# EAGLE schematic MultiDrop (EAGLE 7.6.0)
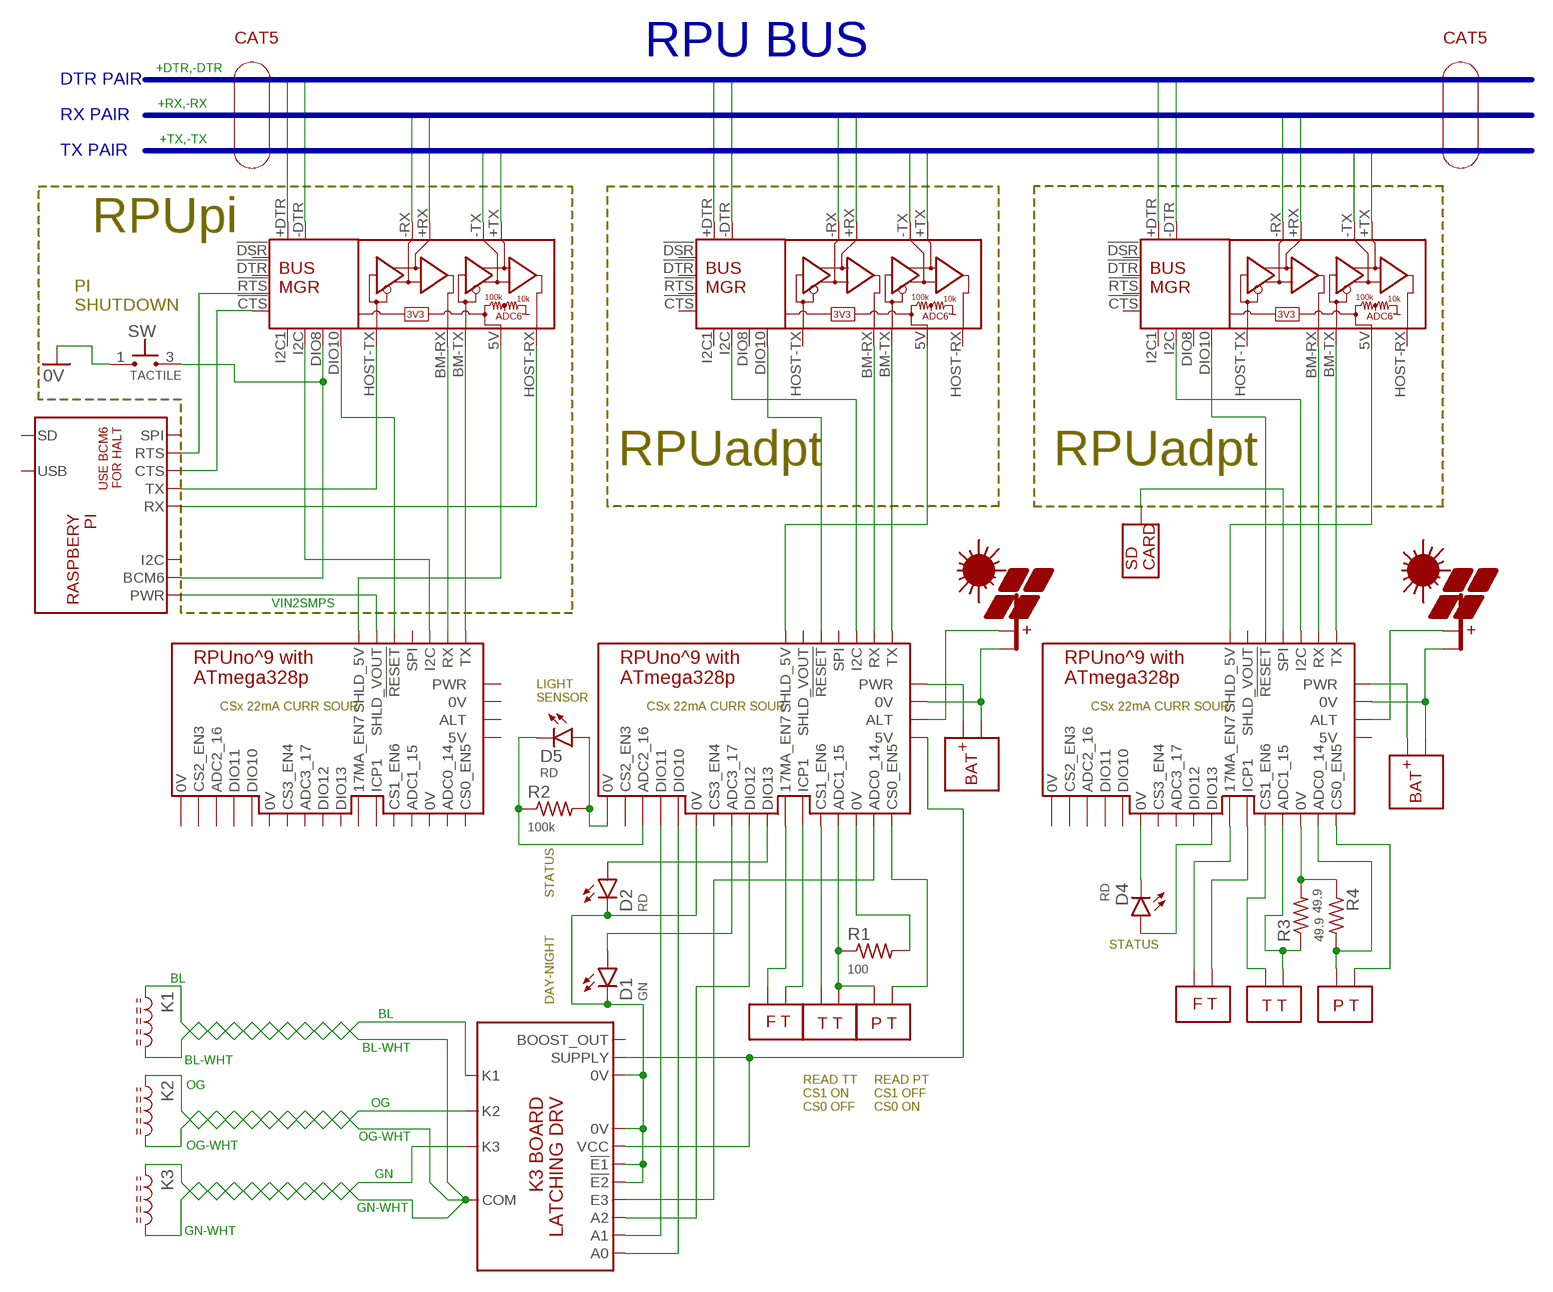
[diagram p0: schematic, sheet 1]

## Parts
BM1  RPUNO  [NA-30]
BM2  RPUNO  [NA-30]
BM3  RPUNO  [NA-30]
D1  GN  LED5MM  [LED5MM]
D2  RD  LED5MM  [LED5MM]
D4  RD  LED5MM  [LED5MM]
D5  RD  LED5MM  [LED5MM]
K1  L0805  [C0805(2012)]
K2  L0805  [C0805(2012)]
K3  L0805  [C0805(2012)]
PV2  PV  [NA-30]
PV4  PV  [NA-30]
R1  100  R0805  [C0805(2012)]
R2  100k  R0805  [C0805(2012)]
R3  49.9  R0805  [C0805(2012)]
R4  49.9  R0805  [C0805(2012)]
SD2  SD  [NA-30]
SW  TACTILE  TAC_SW  [KS11]
U$1  BUS_MGR  [WITH_RPU_NAMES]
U$2  BUS_MGR  [WITH_RPU_NAMES]
U$3  BUS_MGR  [WITH_RPU_NAMES]
U$4  K3  [NA-30]
U$5  FT  [NA-30]
U$6  TT  [NA-30]
U$7  BAT  [NA-30]
U$8  PT  [NA-30]
U$9  BAT  [NA-30]
U$10  TT  [NA-30]
U$11  PT  [NA-30]
U$12  FT  [NA-30]
U$13  PI  [NA-30]

## Nets
0V: SW.1
+DTR: U$3.+DTR
+DTR1: U$2.+DTR
+DTR3: U$1.+DTR
+RX: U$3.+RX
+RX1: U$2.+RX
+RX3: U$1.+RX
+TX: U$3.+TX
+TX1: U$2.+TX
+TX3: U$1.+TX
-DTR: U$3.-DTR
-DTR1: U$2.-DTR
-DTR3: U$1.-DTR
-RX: U$3.-RX
-RX1: U$2.-RX
-RX3: U$1.-RX
-TX: U$3.-TX
-TX1: U$2.-TX
-TX3: U$1.-TX
BL: K1.1 U$4.11(K1)
BL-WHT: K1.2 U$4.9(COM)
GN: K3.1 U$4.13(K3)
GN-WHT: K3.2
N$1: BM2.1(TX) U$3.BM-TX(BM_TX)
N$2: BM2.2(RX) U$3.BM-RX(BM_RX)
N$3: SW.3 U$3.DIO8 U$13.7(BCM6)
N$4: U$3.!CTS U$13.1(CTS)
N$5: U$3.!RTS U$13.2(RTS)
N$6: BM1.27(0V) D5.A R2.2
N$7: BM1.13(ADC2_16) D5.K R2.1
N$8: U$3.HOST-RX(HOST_RX) U$13.3(RX)
N$9: U$3.HOST-TX(HOST_TX) U$13.4(TX)
N$10: BM1.1(TX) U$2.BM-TX(BM_TX)
N$11: BM1.2(RX) U$2.BM-RX(BM_RX)
N$12: BM1.9(0V) PV2.2(-PV) U$9.2(-BAT)
N$13: BM3.9(0V) PV4.2(-PV) U$7.2(-BAT)
N$14: BM3.1(TX) U$1.BM-TX(BM_TX)
N$15: BM3.20(ALT) PV4.1(+PV)
N$16: BM3.8(PWR) U$7.1(+BAT)
N$17: BM1.19(5V) U$4.14(SUPPLY) U$4.15(VCC)
N$18: BM3.26(0V) R3.2 R4.1
N$19: BM1.11(ADC0_14) U$4.10(E3)
N$20: BM3.18(DIO13) D4.A
N$21: BM3.2(RX) U$1.BM-RX(BM_RX)
N$22: BM1.20(ALT) PV2.1(+PV)
N$23: BM3.21(17MA_EN7) U$12.2(PWR)
N$24: BM1.15(DIO10) U$4.5(A0)
N$25: BM1.14(DIO11) U$4.6(A1)
N$26: BM1.17(DIO12) U$4.7(A2)
N$27: BM1.26(0V) R1.2
N$28: BM3.4(SPI) SD2.1(PV_PWR)
N$29: BM2.6(SHLD_5V) U$3.5V(PWR)
N$30: BM2.5(!RESET) U$3.DIO10
N$31: BM3.10(ADC1_15) R3.1 U$10.1(4TO20)
N$32: BM3.3(I2C) U$1.I2C
N$33: BM2.3(I2C) U$3.I2C
N$34: BM3.22(CS1_EN6) U$10.2(PWR)
N$35: BM3.12(ICP1) U$12.1(PL)
N$36: BM1.18(DIO13) D2.A
N$37: BM1.16(ADC3_17) D1.A
N$38: BM3.11(ADC0_14) R4.2 U$8.2(PWR)
N$39: BM3.23(CS0_EN5) U$8.1(4TO20)
N$40: BM1.28(0V) D1.K D2.K U$4.1(!E1) U$4.2(!E2) U$4.3(0V) U$4.4(0V)
N$41: BM3.6(SHLD_5V) U$1.5V(PWR)
N$42: BM1.8(PWR) U$9.1(+BAT)
N$43: BM3.5(!RESET) U$1.DIO10
N$44: BM1.5(!RESET) U$2.DIO10
N$45: BM1.6(SHLD_5V) U$2.5V(PWR)
N$47: BM1.21(17MA_EN7) U$5.2(PWR)
N$48: BM1.3(I2C) U$2.I2C
N$49: BM1.12(ICP1) U$5.1(PL)
N$50: BM1.22(CS1_EN6) U$6.2(PWR)
N$51: BM1.10(ADC1_15) R1.1 U$6.1(4TO20) U$11.2(PWR)
N$53: BM1.23(CS0_EN5) U$11.1(4TO20)
N$56: BM3.28(0V) D4.K
OG: K2.1 U$4.12(K2)
OG-WHT: K2.2
VIN2SMPS: BM2.7(SHLD_VOUT) U$13.12(PWR)
Unconnected: BM1.4(SPI) BM1.7(SHLD_VOUT) BM1.24(CS2_EN3) BM1.29(CS3_EN4) BM2.4(SPI) BM2.8(PWR) BM2.9(0V) BM2.10(ADC1_15) BM2.11(ADC0_14) BM2.12(ICP1) BM2.13(ADC2_16) BM2.14(DIO11) BM2.15(DIO10) BM2.16(ADC3_17) BM2.17(DIO12) BM2.18(DIO13) BM2.19(5V) BM2.20(ALT) BM2.21(17MA_EN7) BM2.22(CS1_EN6) BM2.23(CS0_EN5) BM2.24(CS2_EN3) BM2.26(0V) BM2.27(0V) BM2.28(0V) BM2.29(CS3_EN4) BM3.7(SHLD_VOUT) BM3.13(ADC2_16) BM3.14(DIO11) BM3.15(DIO10) BM3.16(ADC3_17) BM3.17(DIO12) BM3.19(5V) BM3.24(CS2_EN3) BM3.27(0V) BM3.29(CS3_EN4) U$1.!CTS U$1.!DSR U$1.!DTR U$1.!RTS U$1.DIO8 U$1.HOST-RX(HOST_RX) U$1.HOST-TX(HOST_TX) U$1.I2C1 U$2.!CTS U$2.!DSR U$2.!DTR U$2.!RTS U$2.DIO8 U$2.HOST-RX(HOST_RX) U$2.HOST-TX(HOST_TX) U$2.I2C1 U$3.!DSR U$3.!DTR U$3.I2C1 U$4.8(BOOST_OUT) U$13.8(I2C) U$13.9(SD) U$13.10(SPI) U$13.11(USB)

## Buses
+DTR,-DTR
+RX,-RX
+TX,-TX

## Notes on the sheet
- CAT5 | CAT5
- RPU BUS
- DTR PAIR
- RX PAIR
- TX PAIR
- RPUpi
- PI
  SHUTDOWN
- RPUadpt | RPUadpt
- LIGHT
  SENSOR
- STATUS
- STATUS
- DAY-NIGHT
- READ TT
  CS1 ON 
  CS0 OFF
- READ PT 
  CS1 OFF 
  CS0 ON

## Library data of the parts
BM1-BM3 = Documentation:RPUNO: BM /w 328p
D1 D2 D4 D5 = D-LED:LED: LED 120120WH [CREE,XHGAWT-00-0000-00000HXE1] LED WHITE 6500K 150LUM-W120120
K1-K3 = L-PWR:L: Inductor
PV2 PV4 = Documentation:PV
R1-R4 = R-C:R: Resiistor American-style symbol
SD2 = Documentation:SD
SW = S-Tactile:TAC_SW: KS11 [C&K,KS11R21CQE] SWITCH PUSHBUTTON SPST-NO 25MA 50V PAD 0805
U$1-U$3 = Documentation:BUS_MGR: RPU BUS MANAGER
U$4 = Documentation:K3: Latching Solenoids
U$5 U$12 = Documentation:FT
U$6 U$10 = Documentation:TT
U$7 U$9 = Documentation:BAT
U$8 U$11 = Documentation:PT
U$13 = Documentation:PI: Raspbery Pi